# EasyEDA Pro project JLCEDA_AT_START_A423_V1.1.epro, schematic AT-START-A423

## Sheets
1 AT-Link-EZ V1.4: Create Date: 2024-03-27; Page Name: AT-Link-EZ V1.4; Project Name: AT-START-A423 V1.1; Schematic Name: AT-START-A423; Update Date: 2024-03-29; Company: Artery Technology; Page Size: A4; Version: 1.1
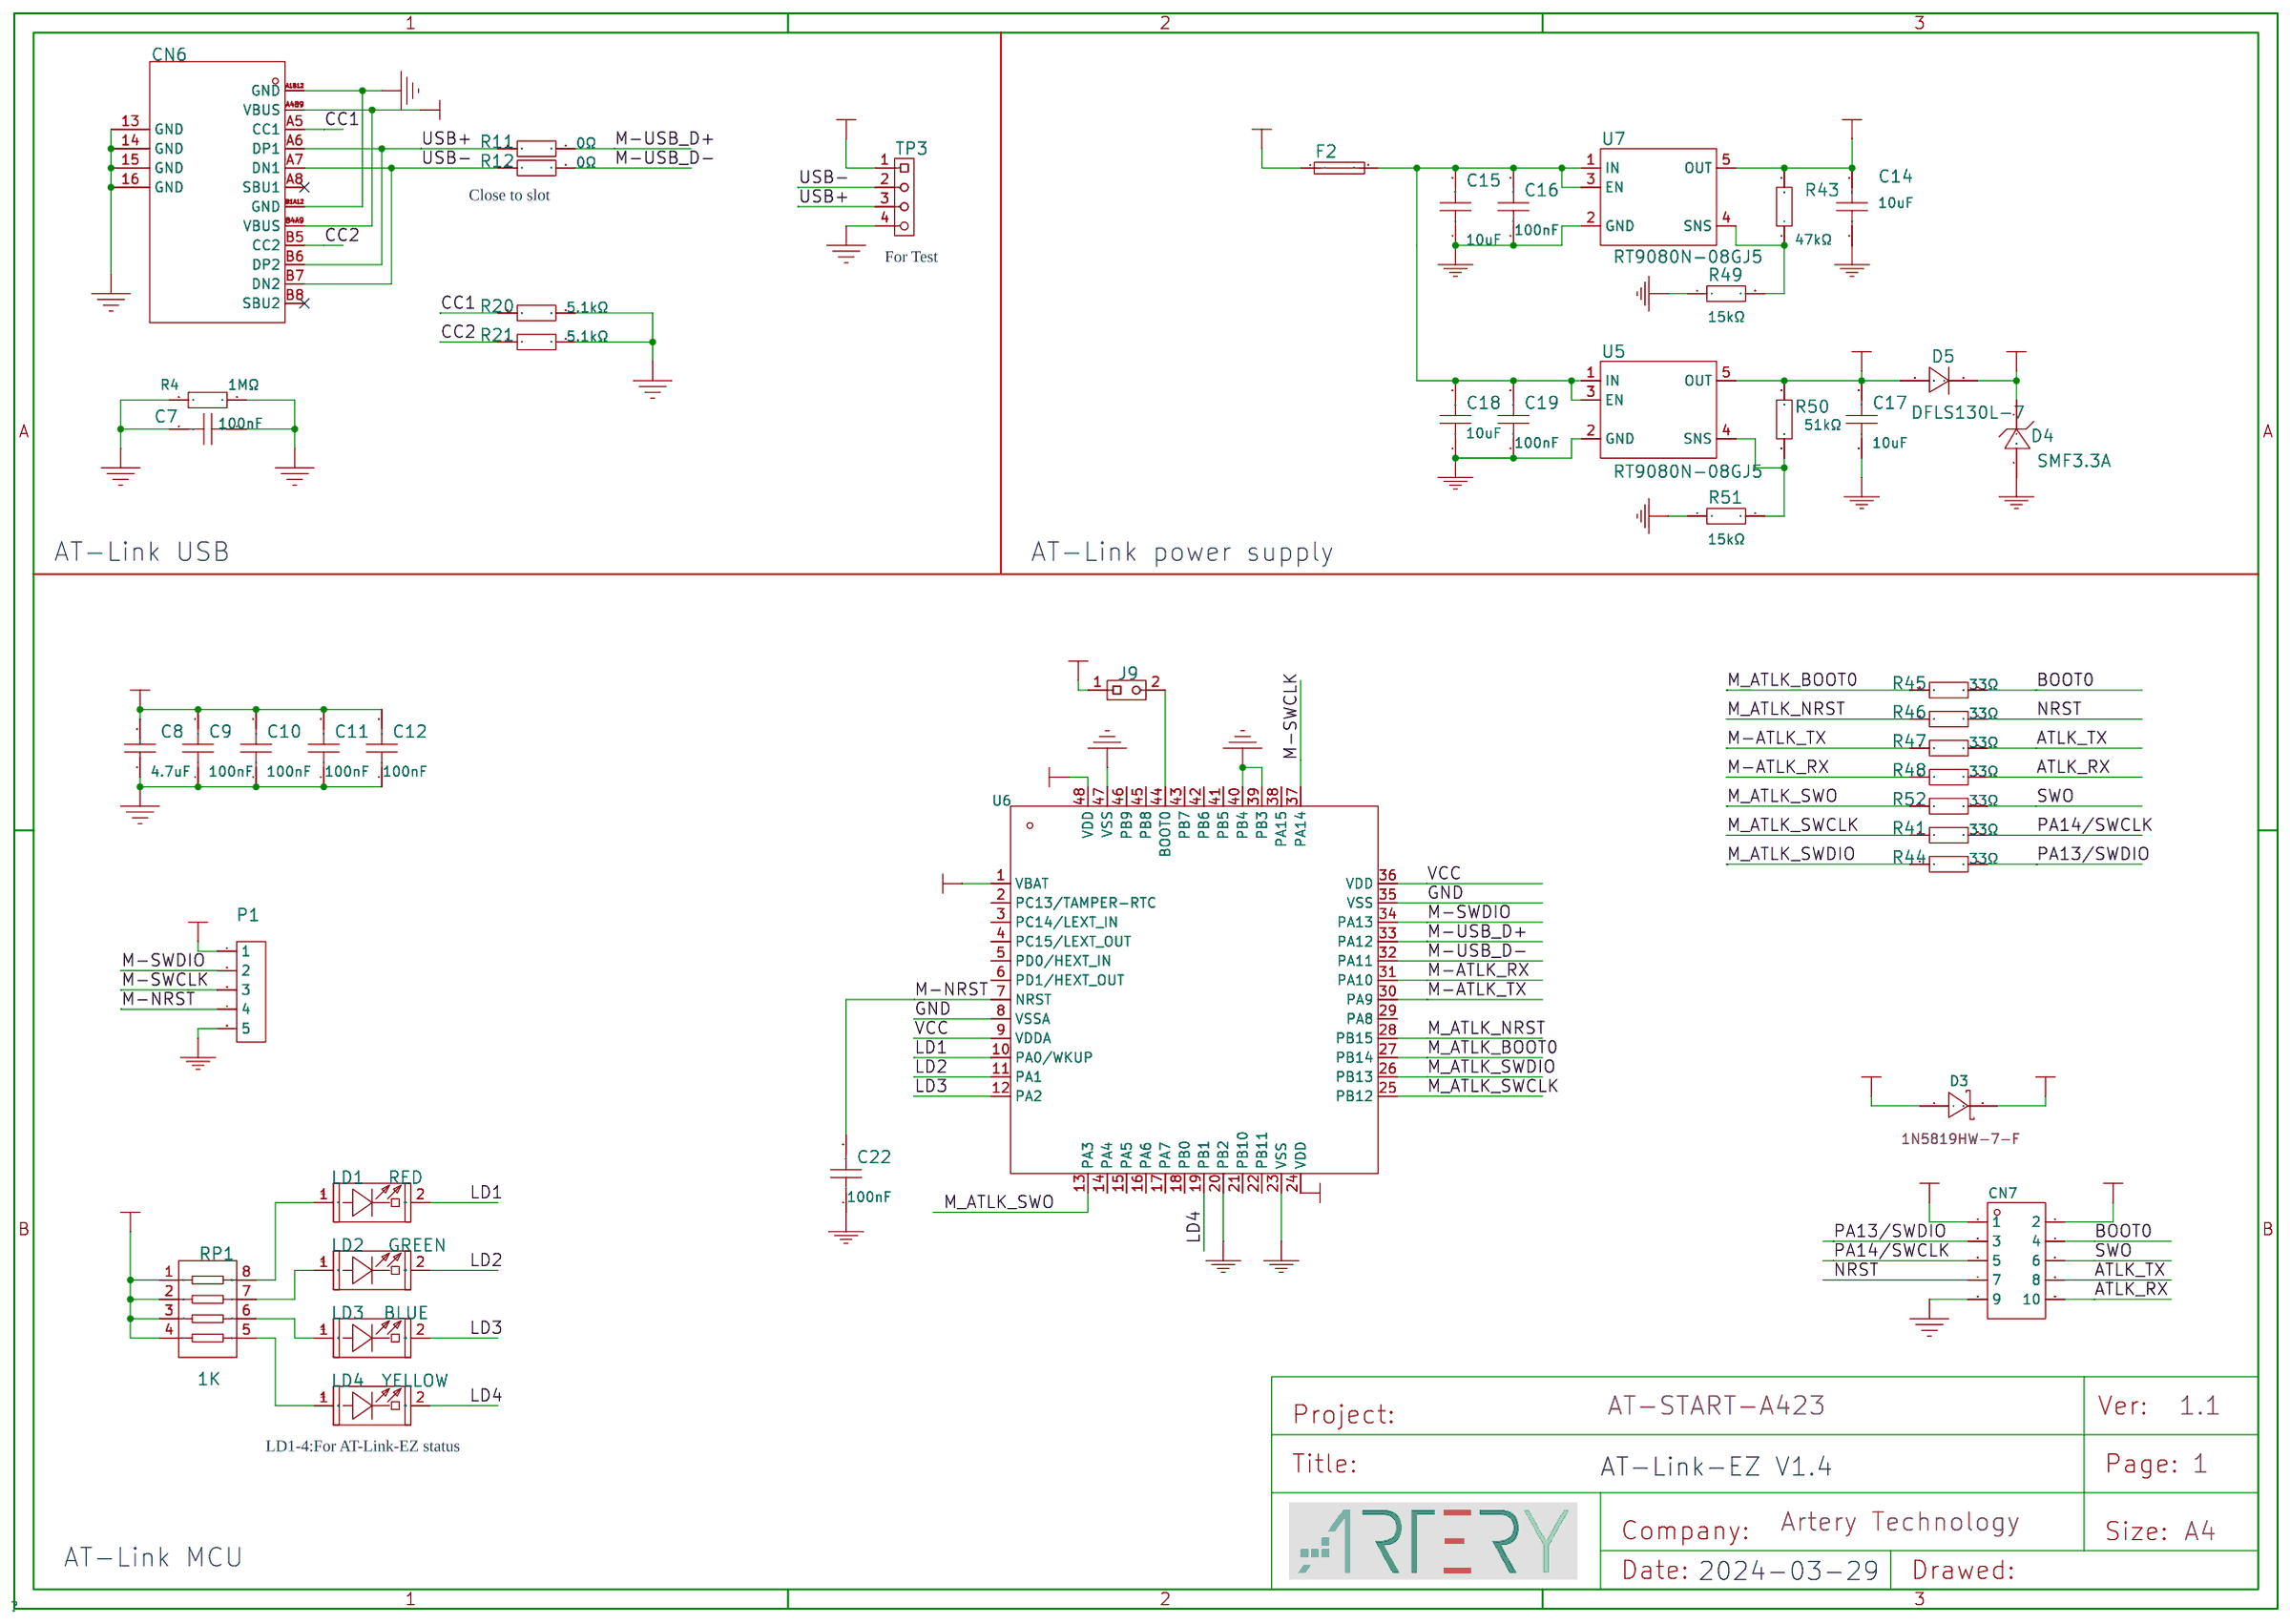
[diagram p0: AT-Link-EZ V1.4]
2 MCU: Page Name: MCU
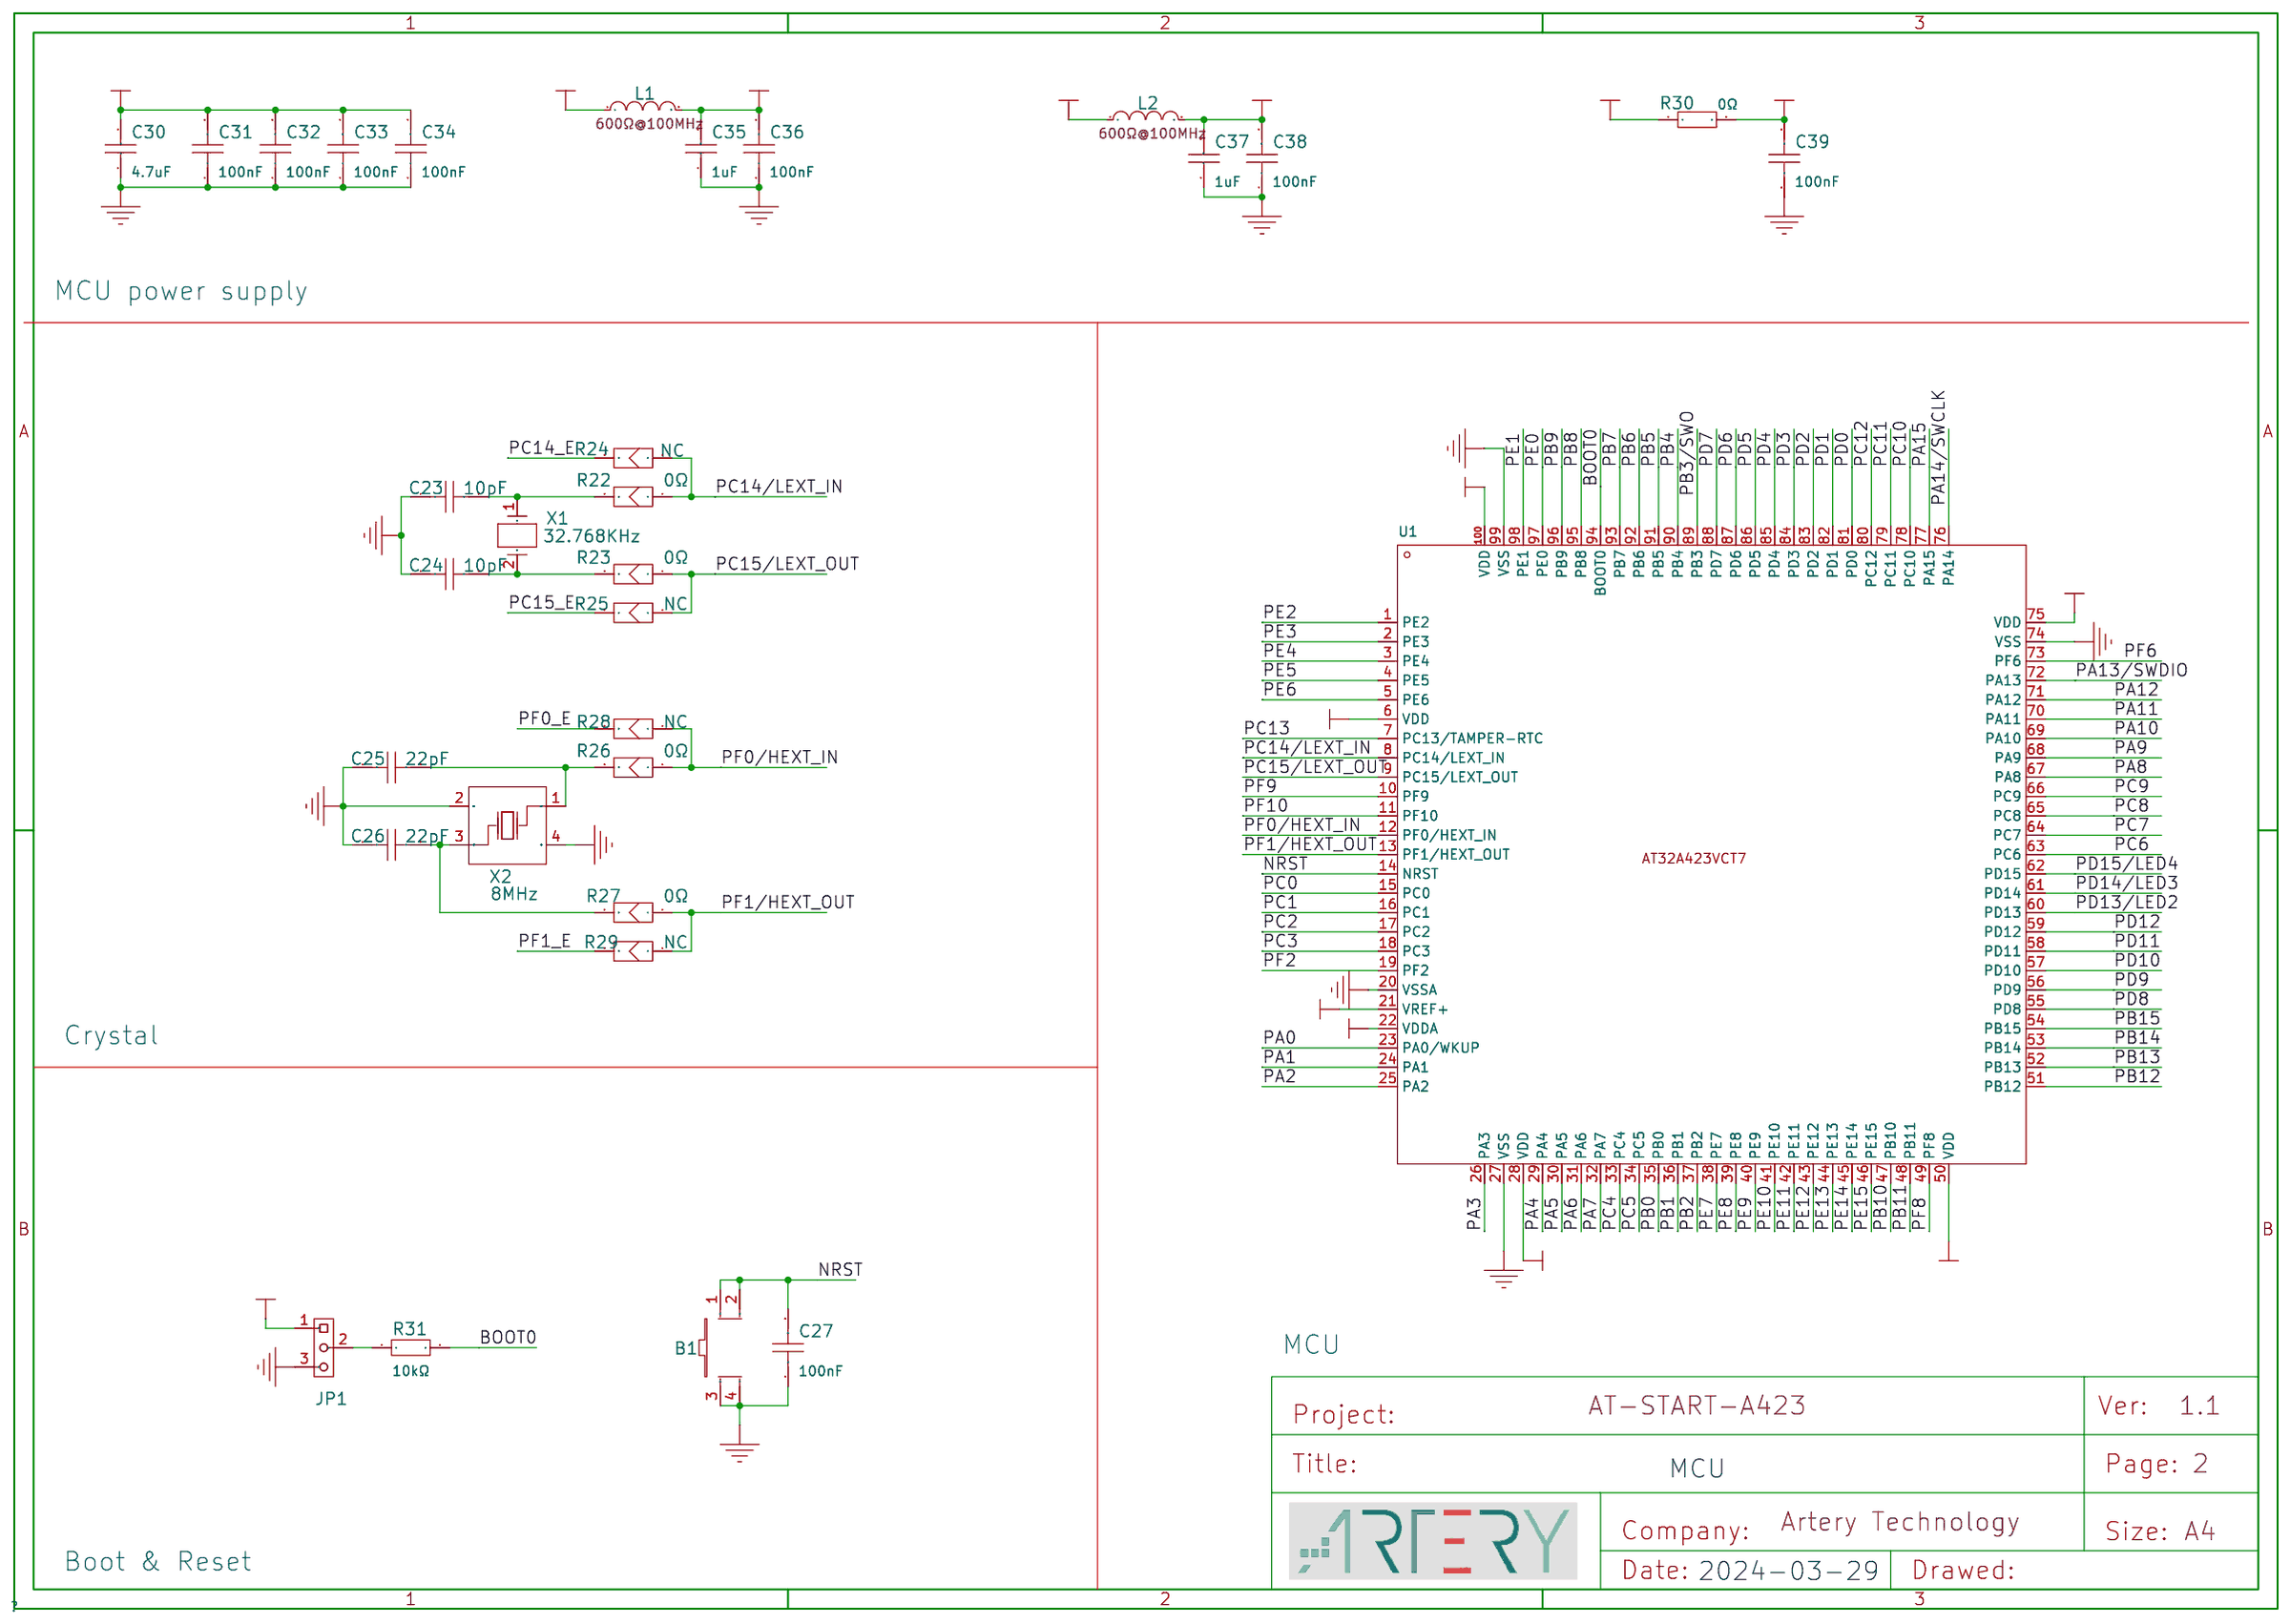
[diagram p1: MCU]
3 Power&Peripherals: Page Name: Power&Peripherals
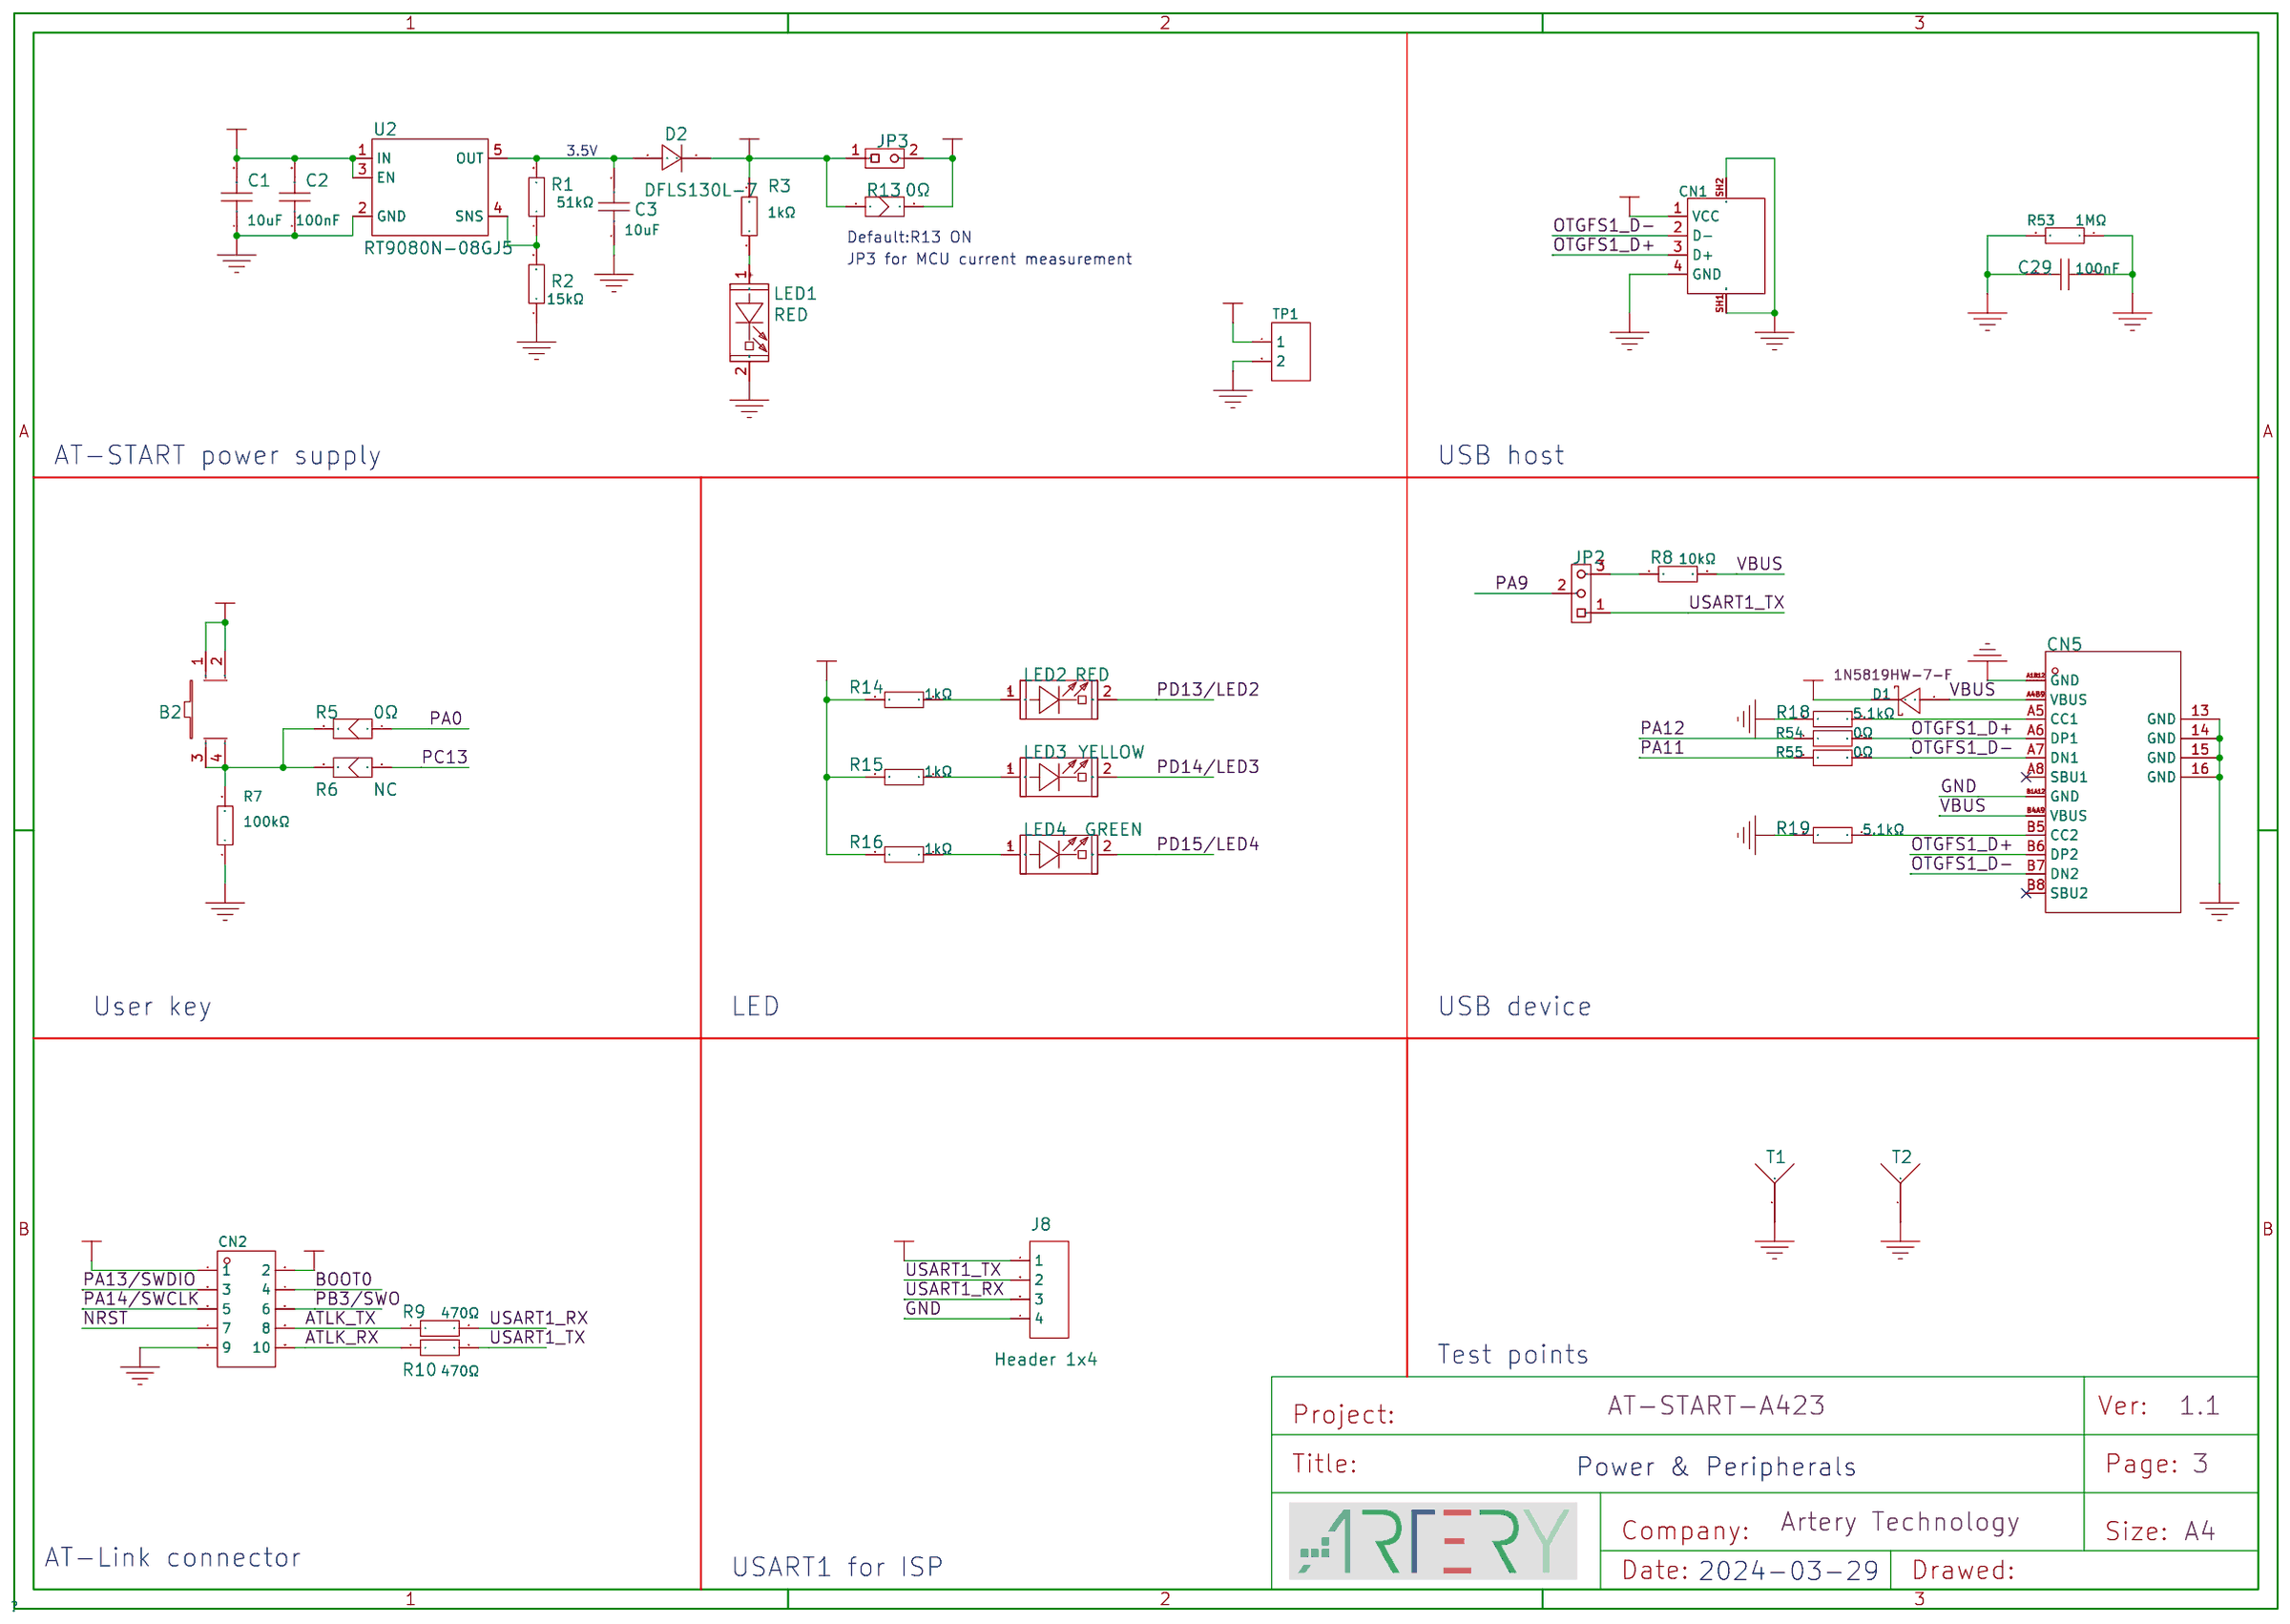
[diagram p2: Power&Peripherals]
4 Extension connectors: Page Name: Extension connectors; Update Date: 2024-04-30
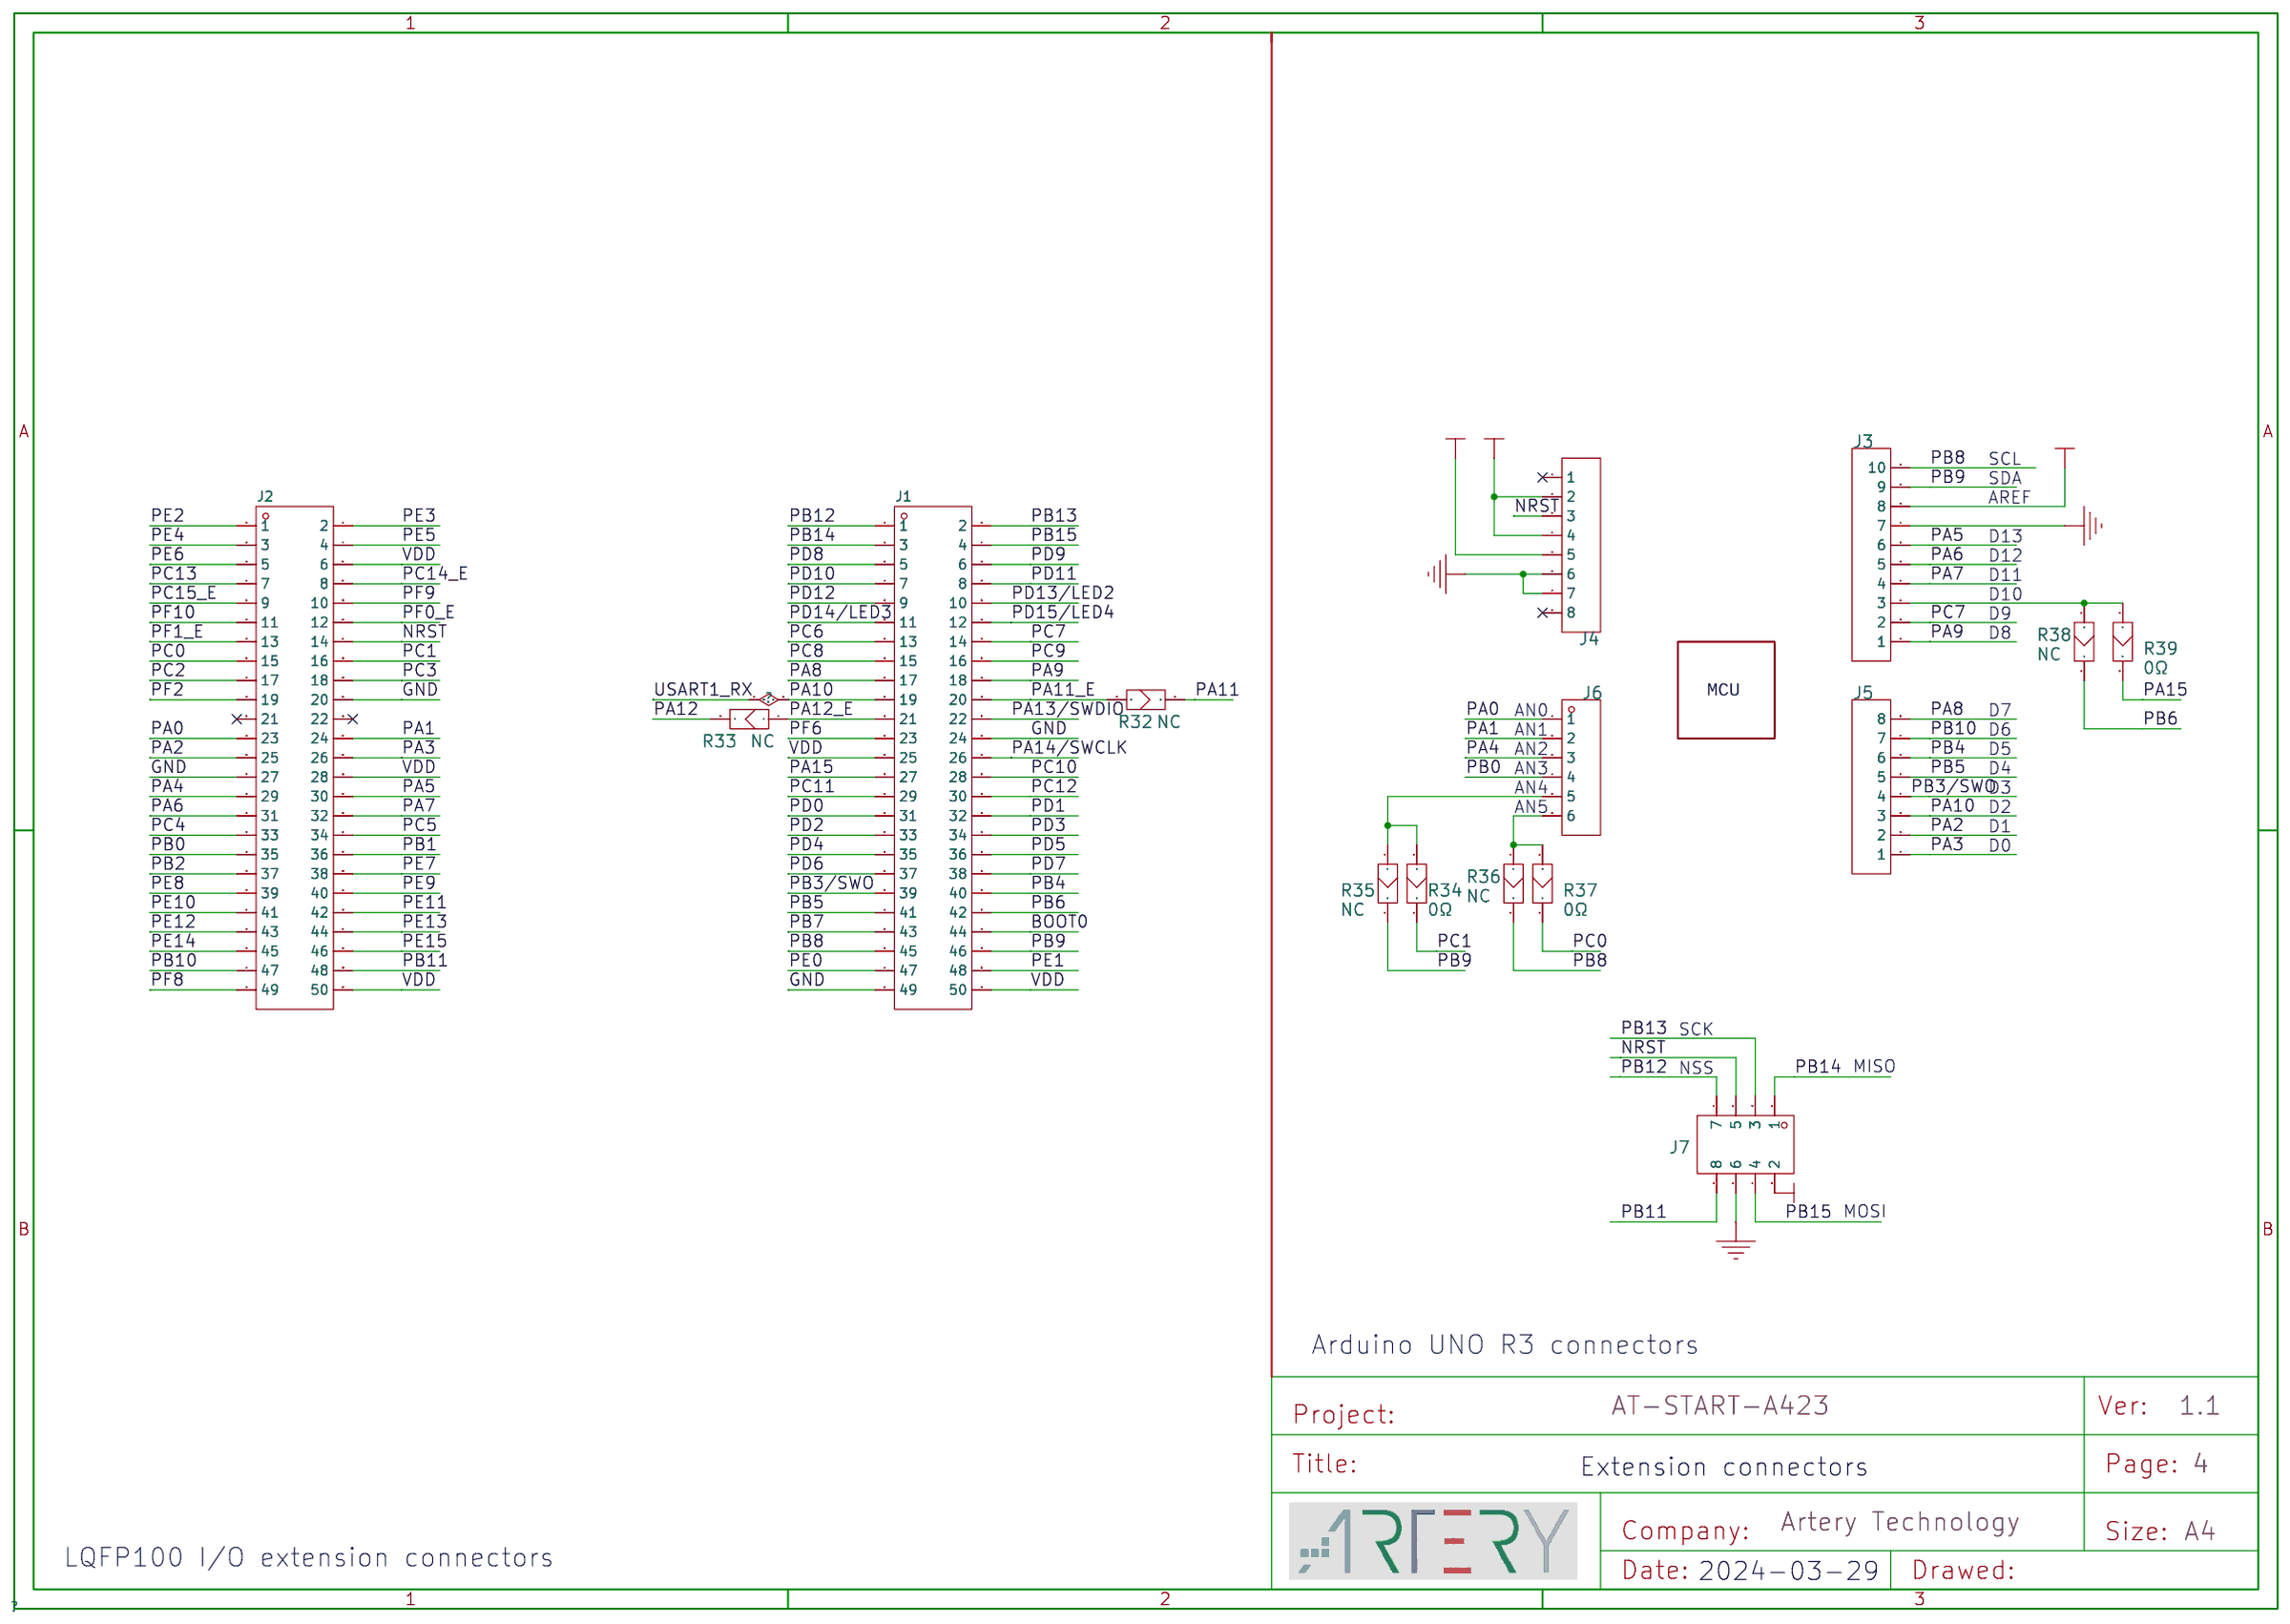
[diagram p3: Extension connectors]

## Parts
sheet AT-Link-EZ V1.4
C7  100nF  [C0603]
C8  4.7uF  [C0603]
C9  100nF  [C0603]
C10  100nF  [C0603]
C11  100nF  [C0603]
C12  100nF  [C0603]
C14  10uF  [C0603]
C15  10uF  [C0603]
C16  100nF  [C0603]
C17  10uF  [C0603]
C18  10uF  [C0603]
C19  100nF  [C0603]
C22  100nF  [C0603]
CN6  -  [USB-C-SMD_TYPEC-304-BCP16]
CN7  -  [HDR-TH_10P-P2.54-V-M-R2-C5-S2.54]
D3  1N5819HW-7-F  [SOD-123_L2.8-W1.8-LS3.7-FD]
D4  SMF3.3A  [SOD-123_L2.8-W1.8-LS3.7-RD]
D5  DFLS130L-7  [POWERDI-123_L2.8-W1.8-LS3.7-RD]
F2  SMD0603B050TF  [R0603]
J9  1X2P,Male,DIP_2.54  [HDR1X2]
LD1  RED  [LED0603]
LD2  GREEN  [LED0603]
LD3  BLUE  [LED0603]
LD4  YELLOW  [LED0603]
P1  HDR-M-2.54_1x5  [HDR-M-2.54_1X5]
R4  1MΩ  [R0603]
R11  0Ω  [R0603]
R12  0Ω  [R0603]
R20  5.1kΩ  [R0603]
R21  5.1kΩ  [R0603]
R41  33Ω  [R0603]
R43  47kΩ  [R0603]
R44  33Ω  [R0603]
R45  33Ω  [R0603]
R46  33Ω  [R0603]
R47  33Ω  [R0603]
R48  33Ω  [R0603]
R49  15kΩ  [R0603]
R50  51kΩ  [R0603]
R51  15kΩ  [R0603]
R52  33Ω  [R0603]
RP1  1K  [0603*4,8P4R]
TP3  1X4P_2.54F  [HDR1X4 - TOP]
U5  RT9080N-08GJ5  [SOT-23-5]
U6  -  [LQFP-48_L7.0-W7.0-P0.50-LS9.0-BL]
U7  RT9080N-08GJ5  [SOT-23-5(1)]
sheet Extension connectors
J1  X6521WV-2x25H-C30D60  [HDR-TH_50P-2.54-V-M-R2-C25-S2.54]
J2  X6521WV-2x25H-C30D60  [HDR-TH_50P-2.54-V-M-R2-C25-S2.54]
J3  -  [AT-START-Connector 1x10]
J4  -  [AT-START-Connector 1x8]
J5  -  [AT-START-Connector 1x8]
J6  -  [AT-START-Connector 1x6]
J7  Header 4X2  [HDR2X4]
R32  NC  [SB-PAD]
R33  NC  [SB-PAD]
R34  0Ω  [SB-PAD]
R35  NC  [SB-PAD]
R36  NC  [SB-PAD]
R37  0Ω  [SB-PAD]
R38  NC  [SB-PAD]
R39  0Ω  [SB-PAD]
sheet MCU
B1  BUTTON_SMT,6.0x6.0x4.5mm  [BUTTON_SMT_6*6*5]
C23  10pF  [0603_C-M]
C24  10pF  [0603_C-M]
C25  22pF  [0603_C-M(1)]
C26  22pF  [0603_C-M(1)]
C27  100nF  [C0603]
C30  4.7uF  [C0603]
C31  100nF  [C0603]
C32  100nF  [C0603]
C33  100nF  [C0603]
C34  100nF  [C0603]
C35  1uF  [C0603]
C36  100nF  [C0603]
C37  1uF  [C0603]
C38  100nF  [C0603]
C39  100nF  [C0603]
JP1  Header 1x3  [HEADER 1X3]
L1  -  [L0603]
L2  -  [L0603]
R22  0Ω  [SB-PAD]
R23  0Ω  [SB-PAD]
R24  NC  [SB-PAD]
R25  NC  [SB-PAD]
R26  0Ω  [SB-PAD]
R27  0Ω  [SB-PAD]
R28  NC  [SB-PAD]
R29  NC  [SB-PAD]
R30  0Ω  [R0603]
R31  10kΩ  [R0603]
U1  -  [LQFP-100_L14.0-W14.0-P0.50-LS16.0-TL]
X1  32.768KHz  [XTAL_SOP - FC-12M]
X2  8MHz  [OSC-SMD_4P-L5.0-W3.2-BL]
sheet Power&Peripherals
B2  BUTTON_SMT,6.0x6.0x4.5mm  [BUTTON_SMT_6*6*5]
C1  10uF  [C0603]
C2  100nF  [C0603]
C3  10uF  [C0603]
C29  100nF  [C0603]
CN1  902-131A1011D10100  [USB-A-TH__USB-AF-90]
CN2  -  [HDR-TH_10P-P2.54-V-M-R2-C5-S2.54]
CN5  -  [USB-C-SMD_TYPEC-304-BCP16]
D1  1N5819HW-7-F  [SOD-123_L2.8-W1.8-LS3.7-FD]
D2  DFLS130L-7  [POWERDI-123_L2.8-W1.8-LS3.7-RD]
J8  Header 1x4  [HDR1X4]
JP2  Header 1x3  [HEADER 1X3]
JP3  NC(Header 1x2)  [HDR1X2]
LED1  RED  [LED0603]
LED2  RED  [LED0603]
LED3  YELLOW  [LED0603]
LED4  GREEN  [LED0603]
R1  51kΩ  [R0603]
R2  15kΩ  [R0603]
R3  1kΩ  [R0603]
R5  0Ω  [SB-PAD]
R6  NC  [SB-PAD]
R7  100kΩ  [R0603]
R8  10kΩ  [R0603]
R9  470Ω  [R0603]
R10  470Ω  [R0603]
R13  0Ω  [SB-PAD]
R14  1kΩ  [R0603]
R15  1kΩ  [R0603]
R16  1kΩ  [R0603]
R18  5.1kΩ  [R0603]
R19  5.1kΩ  [R0603]
R53  1MΩ  [R0603]
R54  0Ω  [R0603]
R55  0Ω  [R0603]
T1  Testpoint  [TESTHOOK]
T2  Testpoint  [TESTHOOK]
TP1  -  [AT-START-TEST-POINT 1X2]
U2  RT9080N-08GJ5  [SOT-23-5(1)]

## Library data of the parts
C2 C7 C9-C12 C16 C19 C22 C27 C29 C31-C34 C36 C38 C39 = CC0603KRX7R9BB104: 容值:100nF;精度:±10%;额定电压:50V;温度系数:X7R;; LCSC Part Name: 100nF ±10% 50V; Supplier Part: C14663; Manufacturer: YAGEO(国巨); Supplier Footprint: 0603; JLCPCB Part Class: Basic Part; Datasheet: https://atta.szlcsc.com/upload/public/pdf/source/20170116/1484561234239.pdf; Supplier: LCSC; Tolerance: ±10%; Voltage Rated: 50V; Temperature Coefficient: X7R
C8 C30 = CL10A475KO8NNNC: 容值:4.7uF;精度:±10%;额定电压:16V;温度系数:X5R;; LCSC Part Name: 4.7uF ±10% 16V; Supplier Part: C19666; Manufacturer: SAMSUNG(三星); Supplier Footprint: 0603; JLCPCB Part Class: Basic Part; Datasheet: https://atta.szlcsc.com/upload/public/pdf/source/20160103/1457707703134.pdf; Supplier: LCSC; Tolerance: ±10%; Voltage Rated: 16V; Temperature Coefficient: X5R
C1 C3 C14 C15 C17 C18 = CL10A106KP8NNNC: 容值:10uF;精度:±10%;额定电压:10V;温度系数:X5R;; LCSC Part Name: 10uF ±10% 10V; Supplier Part: C19702; Manufacturer: SAMSUNG(三星); Supplier Footprint: 0603; JLCPCB Part Class: Basic Part; Datasheet: https://atta.szlcsc.com/upload/public/pdf/source/20160103/1457707703378.pdf; Supplier: LCSC; Tolerance: ±10%; Voltage Rated: 10V; Temperature Coefficient: X5R
CN5 CN6 = TYPEC-304-BCP16: 连接器类型:Type-C;标准:USB 3.1;公母:母座;触点数量:16.0;端口数量:1;安装方式:卧贴;额定电流 - 电源:3A;工作温度范围:-25~+85;焊接温度(最大值):260;; Supplier Part: C720629; Manufacturer: XUNPU(讯普); Supplier Footprint: SMD; JLCPCB Part Class: Extended Part; Datasheet: https://atta.szlcsc.com/upload/public/pdf/source/20211022/DACD6552F639E9483017DE6DC0E61150.pdf; Supplier: LCSC; Connector Type: Type-C; Standard: USB 3.1; Gender: 母座; Number of Contacts: 16.0; Number of Ports: 1; Mounting Sytle: 卧贴; Current Rating - Power (Max): 3A; Operating Temperature Range: -25~+85; Welding Temperature (Max): 260
CN2 CN7 = Z-21310110021001: 间距:2.54mm;总PIN位数:10;排数:2;插针结构:-;行距:2.54mm;安装类型:直插;圆针/方针:-;额定电流:-;额定电压:-;配合针长度:-;塑高:-;触头材质:黄铜;触头镀层:-;颜色:黑色;; LCSC Part Name: 2.54mm; Supplier Part: C115170; Manufacturer: Nextron(台湾正凌); Supplier Footprint: 插件,P=2.54mm; JLCPCB Part Class: Extended Part; Datasheet: https://atta.szlcsc.com/upload/public/pdf/source/20170626/1498446033809.pdf; Supplier: LCSC; Pitch: 2.54mm; Number of Pins: 10; Number of Rows: 2; Row Spacing: 2.54mm; Mounting Type: 直插; Contact Material: 黄铜; Color: 黑色
D1 D3 = 1N5819HW-7-F: 直流反向耐压(Vr):40V;平均整流电流(Io):1A;正向压降(Vf):450mV@1A;; LCSC Part Name: 40V 1A 450mV@1A; Supplier Part: C82544; Manufacturer: DIODES(美台); Supplier Footprint: SOD-123; JLCPCB Part Class: 扩展库; Datasheet: https://atta.szlcsc.com/upload/public/pdf/source/20161024/1477288459223.pdf; Supplier: LCSC; Reverse Voltage (Vr): 40V; Average Rectified Current (Io): 1A; Forward Voltage (Vf@If): 450mV@1A
D4 = SMF3.3A: Supplier: LCSC; Supplier Part: C283866; Manufacturer: DOWO; Paste Type: expand
D2 D5 = DFLS130L-7_POWERDI-123_L2.8-W1.8-LS3.7-RD: Supplier: LCSC; Supplier Part: C110493; Manufacturer: Diodes Incorporated; Paste Type: expand
F2 = SMD0603B050TF: Supplier: LCSC; Supplier Part: C269154; Manufacturer: Brightking Elec (TAIWAN); Manufacturer Part: SMD0603B035TF; Paste Type: expand
J9 = 1X2P,Male,DIP_2.54
LD1 = RED
LD2 = GREEN
LD3 = BLUE
LD4 = YELLOW
P1 = HDR-M-2.54_1x5: Supplier Part: C358687; Supplier: LCSC
R4 R53 = RC0603FR-071ML: 阻值:1MΩ;精度:±1%;功率:100mW;温度系数:±100ppm/;最大工作电压:75V;工作温度范围:-55~+155;; LCSC Part Name: 1MΩ ±1%; Supplier Part: C105578; Manufacturer: YAGEO(国巨); Supplier Footprint: 0603; JLCPCB Part Class: Extended Part; Datasheet: https://atta.szlcsc.com/upload/public/pdf/source/20181102/C105578_67A9388250AF143DE4682E62257D2969.pdf; Supplier: LCSC; Tolerance: ±1%; Power(Watts): 100mW; Temperature Coefficient: ±100ppm/; Overload Voltage (Max): 75V; Operating Temperature Range: -55~+155
R11 R12 R30 = 0603WAF0000T5E: 电阻类型:厚膜电阻;阻值:0Ω;精度:±1%;功率:1/10W;温度系数:-;最大工作电压:75V;工作温度范围:-55~+155;; LCSC Part Name: 0Ω ±1%; Supplier Part: C21189; Manufacturer: UNI-ROYAL(厚声); Supplier Footprint: 0603; JLCPCB Part Class: Basic Part; Datasheet: https://atta.szlcsc.com/upload/public/pdf/source/20200306/C422600_1E6D84923E4A46A82E41ADD87F860B5C.pdf; Supplier: LCSC; Type: 厚膜电阻; Tolerance: ±1%; Power(Watts): 1/10W; Overload Voltage (Max): 75V; Operating Temperature Range: -55~+155
R18-R21 = 0603WAF5101T5E: 电阻类型:厚膜电阻;阻值:5.1kΩ;精度:±1%;功率:1/10W;温度系数:±100ppm/;最大工作电压:75V;工作温度范围:-55~+155;; LCSC Part Name: 5.1kΩ ±1%; Supplier Part: C23186; Manufacturer: UNI-ROYAL(厚声); Supplier Footprint: 0603; JLCPCB Part Class: Basic Part; Datasheet: https://atta.szlcsc.com/upload/public/pdf/source/20200306/C422600_1E6D84923E4A46A82E41ADD87F860B5C.pdf; Supplier: LCSC; Type: 厚膜电阻; Tolerance: ±1%; Power(Watts): 1/10W; Temperature Coefficient: ±100ppm/; Overload Voltage (Max): 75V; Operating Temperature Range: -55~+155
R41 R44-R48 R52 = 0603WAF330JT5E: 电阻类型:厚膜电阻;阻值:33Ω;精度:±1%;功率:1/10W;温度系数:±100ppm/;最大工作电压:75V;工作温度范围:-55~+155;; LCSC Part Name: 33Ω ±1%; Supplier Part: C23140; Manufacturer: UNI-ROYAL(厚声); Supplier Footprint: 0603; JLCPCB Part Class: Basic Part; Datasheet: https://atta.szlcsc.com/upload/public/pdf/source/20200306/C422600_1E6D84923E4A46A82E41ADD87F860B5C.pdf; Supplier: LCSC; Type: 厚膜电阻; Tolerance: ±1%; Power(Watts): 1/10W; Temperature Coefficient: ±100ppm/; Overload Voltage (Max): 75V; Operating Temperature Range: -55~+155
R43 = 0603WAF4702T5E: 电阻类型:厚膜电阻;阻值:47kΩ;精度:±1%;功率:1/10W;温度系数:±100ppm/;最大工作电压:75V;工作温度范围:-55~+155;; LCSC Part Name: 47kΩ ±1%; Supplier Part: C25819; Manufacturer: UNI-ROYAL(厚声); Supplier Footprint: 0603; JLCPCB Part Class: Basic Part; Datasheet: https://atta.szlcsc.com/upload/public/pdf/source/20200306/C422600_1E6D84923E4A46A82E41ADD87F860B5C.pdf; Supplier: LCSC; Type: 厚膜电阻; Tolerance: ±1%; Power(Watts): 1/10W; Temperature Coefficient: ±100ppm/; Overload Voltage (Max): 75V; Operating Temperature Range: -55~+155
R2 R49 R51 = 0603WAF1502T5E: 电阻类型:厚膜电阻;阻值:15kΩ;精度:±1%;功率:1/10W;温度系数:±100ppm/;最大工作电压:75V;工作温度范围:-55~+155;; LCSC Part Name: 15kΩ ±1%; Supplier Part: C22809; Manufacturer: UNI-ROYAL(厚声); Supplier Footprint: 0603; JLCPCB Part Class: Basic Part; Datasheet: https://atta.szlcsc.com/upload/public/pdf/source/20200306/C422600_1E6D84923E4A46A82E41ADD87F860B5C.pdf; Supplier: LCSC; Type: 厚膜电阻; Tolerance: ±1%; Power(Watts): 1/10W; Temperature Coefficient: ±100ppm/; Overload Voltage (Max): 75V; Operating Temperature Range: -55~+155
R1 R50 = 0603WAF5102T5E: 电阻类型:厚膜电阻;阻值:51kΩ;精度:±1%;功率:1/10W;温度系数:±100ppm/;最大工作电压:75V;工作温度范围:-55~+155;; LCSC Part Name: 51kΩ ±1%; Supplier Part: C23196; Manufacturer: UNI-ROYAL(厚声); Supplier Footprint: 0603; JLCPCB Part Class: Basic Part; Datasheet: https://atta.szlcsc.com/upload/public/pdf/source/20200306/C422600_1E6D84923E4A46A82E41ADD87F860B5C.pdf; Supplier: LCSC; Type: 厚膜电阻; Tolerance: ±1%; Power(Watts): 1/10W; Temperature Coefficient: ±100ppm/; Overload Voltage (Max): 75V; Operating Temperature Range: -55~+155
RP1 = 1K: Comment: 33R
TP3 = 1X4P_2.54F
U5 = RT9080N-08GJ5
U6 = AT32F403ACxT7: 由官方提供; Manufacturer: Artery Technology
U2 U7 = RT9080N-08GJ5_SOT-23-5
J1 J2 = X6521WV-2x25H-C30D60: 间距:2.54mm;总PIN位数:50;排数:2;插针结构:2x25P;行距:2.54mm;安装类型:直插;圆针/方针:方针;额定电流:3A;额定电压:250V;配合针长度:6mm;塑高:2.5mm;端接针长度:3mm;触头材质:黄铜;触头镀层:金;工作温度范围:-40~+105;焊接温度(最大值):260;颜色:黑色;; LCSC Part Name: 2.54mm 2x25P 直插 方针; Supplier Part: C725897; Manufacturer: XKB Connectivity(中国星坤); Supplier Footprint: 直插,P=2.54mm; JLCPCB Part Class: 扩展库; Datasheet: https://atta.szlcsc.com/upload/public/pdf/source/20211009/DE33EBA4104B5B447A7BD8383FBBA145.pdf; Supplier: LCSC; Pitch: 2.54mm; Number of Pins: 50; Number of Rows: 2; Pin Structure: 2x25P; Row Spacing: 2.54mm; Mounting Type: 直插; Circluar Pins/Square Pins: 方针; Current Rating (Max): 3A; Voltage Rating (Max): 250V; Length of Mating Pin: 6mm; Insulation Height: 2.5mm; Length of End Connection Pin: 3mm; Contact Material: 黄铜; Contact Plating: 金; Operating Temperature Range: -40~+105; Welding Temperature (Max): 260; Color: 黑色
J3 = 2.54-1*10P母: 间距:2.54mm;总孔位数:10;排数:1;插孔结构:1x10P;行距:-;安装类型:直插;塑高:-;触头材质:-;触头镀层:-;; LCSC Part Name: 2.54mm 镀金; Supplier Part: C35445; Manufacturer: BOOMELE(博穆精密); Supplier Footprint: 插件,P=2.54mm; JLCPCB Part Class: Extended Part; Datasheet: https://atta.szlcsc.com/upload/public/pdf/source/20200813/C35445_A4147CED0A1C9075722E373C7771E928.pdf; Supplier: LCSC; Pitch: 2.54mm; Number of Holes: 10; Number of Rows: 1; Holes Structure: 1x10P; Mounting Type: 直插
J4 J5 = 2.54-1*8P母环保: 间距:2.54mm;总孔位数:8;排数:1;插孔结构:1x8P;行距:-;安装类型:直插;塑高:-;触头材质:-;触头镀层:-;; LCSC Part Name: 2.54mm; Supplier Part: C27438; Manufacturer: BOOMELE(博穆精密); Supplier Footprint: 插件,P=2.54mm; JLCPCB Part Class: Extended Part; Datasheet: https://atta.szlcsc.com/upload/public/pdf/source/20151109/1457707554453.pdf; Supplier: LCSC; Pitch: 2.54mm; Number of Holes: 8; Number of Rows: 1; Holes Structure: 1x8P; Mounting Type: 直插
J6 = 2.54-1*6P母: 间距:2.54mm;总孔位数:6;排数:1;插孔结构:1x6P;行距:-;安装类型:直插;塑高:-;触头材质:-;触头镀层:-;; LCSC Part Name: 2.54mm; Supplier Part: C40877; Manufacturer: BOOMELE(博穆精密); Supplier Footprint: 插件,P=2.54mm; JLCPCB Part Class: Extended Part; Datasheet: https://atta.szlcsc.com/upload/public/pdf/source/20151109/1457707559772.pdf; Supplier: LCSC; Pitch: 2.54mm; Number of Holes: 6; Number of Rows: 1; Holes Structure: 1x6P; Mounting Type: 直插
J7 = Header 4X2: LatestRevisionDate: 17-Jul-2002; LatestRevisionNote: Re-released for DXP Platform.; Publisher: Altium Limited
R5 R6 R13 R22-R24 R26-R29 R32-R39 = NC_SB-PAD
B1 = BUTTON_SMT,6.0x6.0x4.5mm
C23 = 10pF
C24 = 10pF_0603_C-M
C25 C26 = 22pF_0603_C-M
C35 C37 = CL10A105KB8NNNC: 容值:1uF;精度:±10%;额定电压:50V;温度系数:X5R;; LCSC Part Name: 1uF ±10% 50V; Supplier Part: C15849; Manufacturer: SAMSUNG(三星); Supplier Footprint: 0603; JLCPCB Part Class: Basic Part; Datasheet: https://atta.szlcsc.com/upload/public/pdf/source/20160103/1457707679084.pdf; Supplier: LCSC; Tolerance: ±10%; Voltage Rated: 50V; Temperature Coefficient: X5R
JP1 JP2 = Header 1x3
L1 L2 = UPZ1608E601-1R0TF: 标称阻抗@测试频率:600Ω@100MHz;误差:±25%;直流电阻(RDC):150mΩ;额定电流:1A;电路数:1;; LCSC Part Name: 600Ω@100MHz ±25%; Supplier Part: C133527; Manufacturer: Sunlord(顺络); Supplier Footprint: 0603; JLCPCB Part Class: Extended Part; Datasheet: https://atta.szlcsc.com/upload/public/pdf/source/20210916/3C06D8971A361A4569490E57F6B8A429.pdf; Supplier: LCSC; Impedance @ Frequency: 600Ω@100MHz; Tolerance: ±25%; DC Resistance: 150mΩ; Current Rating: 1A; Circuits: 1
R25 = NC
R8 R31 = 0603WAF1002T5E: 电阻类型:厚膜电阻;阻值:10kΩ;精度:±1%;功率:1/10W;温度系数:±100ppm/;最大工作电压:75V;工作温度范围:-55~+155;; LCSC Part Name: 10kΩ ±1%; Supplier Part: C25804; Manufacturer: UNI-ROYAL(厚声); Supplier Footprint: 0603; JLCPCB Part Class: Basic Part; Datasheet: https://atta.szlcsc.com/upload/public/pdf/source/20200306/C422600_1E6D84923E4A46A82E41ADD87F860B5C.pdf; Supplier: LCSC; Type: 厚膜电阻; Tolerance: ±1%; Power(Watts): 1/10W; Temperature Coefficient: ±100ppm/; Overload Voltage (Max): 75V; Operating Temperature Range: -55~+155
U1 = AT32F423VCT7
X1 = 32.768KHz
X2 = 8MHz_OSC-SMD_4P-L5.0-W3.2-BL: Supplier: LCSC; Manufacturer: YXC; Manufacturer Part: X50328MSD4SC; Supplier Part: C16422; Paste Type: recommend
B2 = BUTTON_SMT,6.0x6.0x4.5mm_BUTTON_SMT_6*6*5
CN1 = 902-131A1011D10100: 连接器类型:Type-A;标准:USB 2.0;公母:母座;触点数量:4;端口数量:1;; LCSC Part Name: Type-A 母座; Supplier Part: C2345; Manufacturer: 精拓金; Supplier Footprint: 插件; JLCPCB Part Class: 扩展库; Datasheet: https://atta.szlcsc.com/upload/public/pdf/source/20210226/C2345_C912E0062DF8F3B5668E29214CFCD16E.pdf; Supplier: LCSC; Connector Type: Type-A; Standard: USB 2.0; Gender: 母座; Number of Contacts: 4; Number of Ports: 1
J8 = Header 1x4: Supplier Part: C124378; Supplier: LCSC
JP3 = NC(Header 1x2)
LED1 = RED_LED0603(1)
LED2 = RED_LED0603
LED3 = YELLOW_LED0603
LED4 = GREEN_LED0603
R3 R14-R16 = 0603WAF1001T5E: 电阻类型:厚膜电阻;阻值:1kΩ;精度:±1%;功率:1/10W;温度系数:±100ppm/;最大工作电压:75V;工作温度范围:-55~+155;; LCSC Part Name: 1kΩ ±1%; Supplier Part: C21190; Manufacturer: UNI-ROYAL(厚声); Supplier Footprint: 0603; JLCPCB Part Class: Basic Part; Datasheet: https://atta.szlcsc.com/upload/public/pdf/source/20200306/C422600_1E6D84923E4A46A82E41ADD87F860B5C.pdf; Supplier: LCSC; Type: 厚膜电阻; Tolerance: ±1%; Power(Watts): 1/10W; Temperature Coefficient: ±100ppm/; Overload Voltage (Max): 75V; Operating Temperature Range: -55~+155
R7 = 0603WAF1003T5E: 电阻类型:厚膜电阻;阻值:100kΩ;精度:±1%;功率:1/10W;温度系数:±100ppm/;最大工作电压:75V;工作温度范围:-55~+155;; LCSC Part Name: 100kΩ ±1%; Supplier Part: C25803; Manufacturer: UNI-ROYAL(厚声); Supplier Footprint: 0603; JLCPCB Part Class: Basic Part; Datasheet: https://atta.szlcsc.com/upload/public/pdf/source/20200306/C422600_1E6D84923E4A46A82E41ADD87F860B5C.pdf; Supplier: LCSC; Type: 厚膜电阻; Tolerance: ±1%; Power(Watts): 1/10W; Temperature Coefficient: ±100ppm/; Overload Voltage (Max): 75V; Operating Temperature Range: -55~+155
R9 R10 = 0603WAF4700T5E: 电阻类型:厚膜电阻;阻值:470Ω;精度:±1%;功率:1/10W;温度系数:±100ppm/;最大工作电压:75V;工作温度范围:-55~+155;; LCSC Part Name: 470Ω ±1%; Supplier Part: C23179; Manufacturer: UNI-ROYAL(厚声); Supplier Footprint: 0603; JLCPCB Part Class: Basic Part; Datasheet: https://atta.szlcsc.com/upload/public/pdf/source/20200306/C422600_1E6D84923E4A46A82E41ADD87F860B5C.pdf; Supplier: LCSC; Type: 厚膜电阻; Tolerance: ±1%; Power(Watts): 1/10W; Temperature Coefficient: ±100ppm/; Overload Voltage (Max): 75V; Operating Temperature Range: -55~+155
R54 R55 = 0603WAF220JT5E: 电阻类型:厚膜电阻;阻值:22Ω;精度:±1%;功率:100mW;温度系数:±100ppm/;最大工作电压:75V;工作温度范围:-55~+155;; LCSC Part Name: 22Ω ±1% 100mW; Supplier Part: C23345; Manufacturer: UNI-ROYAL(厚声); Supplier Footprint: 0603; JLCPCB Part Class: 基础库; Datasheet: https://atta.szlcsc.com/upload/public/pdf/source/20200306/C422600_1E6D84923E4A46A82E41ADD87F860B5C.pdf; Supplier: LCSC; Type: 厚膜电阻; Tolerance: ±1%; Power(Watts): 100mW; Temperature Coefficient: ±100ppm/; Overload Voltage (Max): 75V; Operating Temperature Range: -55~+155
T1 = Testpoint_TESTHOOK: LatestRevisionDate: 17-Jul-2002; LatestRevisionNote: Re-released for DXP Platform.; Publisher: Altium Limited
T2 = Testpoint: LatestRevisionDate: 17-Jul-2002; LatestRevisionNote: Re-released for DXP Platform.; Publisher: Altium Limited
TP1 = 2.54-1*2P母: 间距:2.54mm;总孔位数:2;排数:1;插孔结构:1x2P;行距:-;安装类型:直插;塑高:-;触头材质:-;触头镀层:-;; LCSC Part Name: 2.54mm; Supplier Part: C49661; Manufacturer: BOOMELE(博穆精密); Supplier Footprint: 插件,P=2.54mm; JLCPCB Part Class: Extended Part; Datasheet: https://atta.szlcsc.com/upload/public/pdf/source/20151109/1457707570988.pdf; Supplier: LCSC; Pitch: 2.54mm; Number of Holes: 2; Number of Rows: 1; Holes Structure: 1x2P; Mounting Type: 直插

## Nets
3V3: CN2.1 CN7.1 D2.1 D4.1 D5.1 J4.2 J4.4 J8.1 JP3.1 R3.2 R13.1 R14.2 R15.2 R16.2
5V: C1.2 C2.2 CN1.1(VCC) CN2.2 CN7.2 D1.2(K) D3.2(K) J4.5 J7.2 TP1.1 U2.1(IN) U2.3(EN)
GND: B1.3 B1.4 C1.1 C2.1 C3.1 C7.1 C8.1 C9.1 C10.1 C11.1 C12.1 C14.1 C15.1 C16.1 C17.1 C18.1 C19.1 C22.1 C23.1 C24.1 C25.1 C26.1 C27.1 C29.1 C30.1 C31.1 C32.1 C33.1 C34.1 C35.1 C36.1 C37.1 C38.1 C39.1 CN1.4(GND) CN2.9 CN5.A1B12(GND) CN5.B1A12(GND) CN6.A1B12(GND) CN6.B1A12(GND) CN7.9 D4.2 J1.24 J1.49 J2.20 J2.27 J3.7 J4.6 J4.7 J7.6 J8.4 JP1.3 LED1.2(CATHODE) P1.5 R2.1 R4.2 R7.1 R18.2 R19.2 R20.2 R21.2 R49.1 R51.1 R53.2 T1.1 T2.1 TP1.2 TP3.4 U1.20(VSSA) U1.27(VSS) U1.74(VSS) U1.99(VSS) U2.2(GND) U5.2(GND) U6.8(VSSA) U6.20(PB2) U6.23(VSS) U6.35(VSS) U6.39(PB3) U6.40(PB4) U6.47(VSS) U7.2(GND) X2.2(GND) X2.4(GND)
VBUS: CN5.A4B9(VBUS) CN5.B4A9(VBUS) D1.1(A) R8.2
VCC: C8.2 C9.2 C10.2 C11.2 C12.2 C14.2 J9.1 P1.1 R43.2 RP1.1 RP1.2 RP1.3 RP1.4 U6.1(VBAT) U6.9(VDDA) U6.24(VDD) U6.36(VDD) U6.48(VDD) U7.5(OUT)
VCC3.5V: C17.2 D5.2 R50.2 U5.5(OUT)
VDD: B2.1 B2.2 C30.2 C31.2 C32.2 C33.2 C34.2 C39.2 J1.25 J1.50 J2.6 J2.28 J2.50 JP1.1 JP3.2 L1.1 L2.1 R13.2 R30.1 R30.2 U1.6(VDD) U1.28(VDD) U1.50(VDD) U1.75(VDD) U1.100(VDD)
VDDA: C35.2 C36.2 L1.2 U1.22(VDDA)
ATLINK_5V: CN6.A4B9(VBUS) CN6.B4A9(VBUS) D3.1(A) F2.1 TP3.1
ATLK_RX: CN2.10 CN7.10 R10.1 R48.2
ATLK_TX: CN2.8 CN7.8 R9.1 R47.2
BOOT0: CN2.4 CN7.4 J1.44 R31.2 R45.2 U1.94(BOOT0)
CC1: CN6.A5(CC1) R20.1
CC2: CN6.B5(CC2) R21.1
EGND: C29.2 CN1.SH1 CN1.SH2 CN5.13(GND) CN5.14(GND) CN5.15(GND) CN5.16(GND) R53.1
EGND2: C7.2 CN6.13(GND) CN6.14(GND) CN6.15(GND) CN6.16(GND) R4.1
LD1: LD1.2(CATHODE) U6.10(PA0/WKUP)
LD2: LD2.2(CATHODE) U6.11(PA1)
LD3: LD3.2(CATHODE) U6.12(PA2)
LD4: LD4.2(CATHODE) U6.19(PB1)
M-ATLK_RX: R48.1 U6.31(PA10)
M-ATLK_TX: R47.1 U6.30(PA9)
M-NRST: C22.2 P1.4 U6.7(NRST)
M-SWCLK: P1.3 U6.37(PA14)
M-SWDIO: P1.2 U6.34(PA13)
M-USB_D+: R11.2 U6.33(PA12)
M-USB_D-: R12.2 U6.32(PA11)
M_ATLK_BOOT0: R45.1 U6.27(PB14)
M_ATLK_NRST: R46.1 U6.28(PB15)
M_ATLK_SWCLK: R41.1 U6.25(PB12)
M_ATLK_SWDIO: R44.1 U6.26(PB13)
M_ATLK_SWO: R52.1 U6.13(PA3)
NRST: B1.1 B1.2 C27.2 CN2.7 CN7.7 J2.14 J4.3 J7.5 R46.2 U1.14(NRST)
OTGFS1_D+: CN1.3(D+) CN5.A6(DP1) CN5.B6(DP2) R54.2
OTGFS1_D-: CN1.2(D-) CN5.A7(DN1) CN5.B7(DN2) R55.2
PA0: J2.23 J6.1 R5.1 U1.23(PA0/WKUP)
PA1: J2.24 J6.2 U1.24(PA1)
PA2: J2.25 J5.2 U1.25(PA2)
PA3: J2.26 J5.1 U1.26(PA3)
PA4: J2.29 J6.3 U1.29(PA4)
PA5: J2.30 J3.6 U1.30(PA5)
PA6: J2.31 J3.5 U1.31(PA6)
PA7: J2.32 J3.4 U1.32(PA7)
PA8: J1.17 J5.8 U1.67(PA8)
PA9: J1.18 J3.1 JP2.2 U1.68(PA9)
PA10: J1.19 J5.3 J8.3 R9.2 U1.69(PA10)
PA11: R32.2 R55.1 U1.70(PA11)
PA11_E: J1.20 R32.1
PA12: R33.2 R54.1 U1.71(PA12)
PA12_E: J1.21 R33.1
PA13/SWDIO: CN2.3 CN7.3 J1.22 R44.2 U1.72(PA13)
PA14/SWCLK: CN2.5 CN7.5 J1.26 R41.2 U1.76(PA14)
PA15: J1.27 R39.2 U1.77(PA15)
PB0: J2.35 J6.4 U1.35(PB0)
PB1: J2.36 U1.36(PB1)
PB2: J2.37 U1.37(PB2)
PB3/SWO: CN2.6 J1.39 J5.4 U1.89(PB3)
PB4: J1.40 J5.6 U1.90(PB4)
PB5: J1.41 J5.5 U1.91(PB5)
PB6: J1.42 R38.2 U1.92(PB6)
PB7: J1.43 U1.93(PB7)
PB8: J1.45 J3.10 R36.2 U1.95(PB8)
PB9: J1.46 J3.9 R35.2 U1.96(PB9)
PB10: J2.47 J5.7 U1.47(PB10)
PB11: J2.48 J7.8 U1.48(PB11)
PB12: J1.1 J7.7 U1.51(PB12)
PB13: J1.2 J7.3 U1.52(PB13)
PB14: J1.3 J7.1 U1.53(PB14)
PB15: J1.4 J7.4 U1.54(PB15)
PC0: J2.15 R37.2 U1.15(PC0)
PC1: J2.16 R34.2 U1.16(PC1)
PC2: J2.17 U1.17(PC2)
PC3: J2.18 U1.18(PC3)
PC4: J2.33 U1.33(PC4)
PC5: J2.34 U1.34(PC5)
PC6: J1.13 U1.63(PC6)
PC7: J1.14 J3.2 U1.64(PC7)
PC8: J1.15 U1.65(PC8)
PC9: J1.16 U1.66(PC9)
PC10: J1.28 U1.78(PC10)
PC11: J1.29 U1.79(PC11)
PC12: J1.30 U1.80(PC12)
PC13: J2.7 R6.1 U1.7(PC13/TAMPER-RTC)
PC14/LEXT_IN: R22.1 R24.1 U1.8(PC14/LEXT_IN)
PC14_E: J2.8 R24.2
PC15/LEXT_OUT: R23.1 R25.1 U1.9(PC15/LEXT_OUT)
PC15_E: J2.9 R25.2
PD0: J1.31 U1.81(PD0)
PD1: J1.32 U1.82(PD1)
PD2: J1.33 U1.83(PD2)
PD3: J1.34 U1.84(PD3)
PD4: J1.35 U1.85(PD4)
PD5: J1.36 U1.86(PD5)
PD6: J1.37 U1.87(PD6)
PD7: J1.38 U1.88(PD7)
PD8: J1.5 U1.55(PD8)
PD9: J1.6 U1.56(PD9)
PD10: J1.7 U1.57(PD10)
PD11: J1.8 U1.58(PD11)
PD12: J1.9 U1.59(PD12)
PD13/LED2: J1.10 LED2.2(CATHODE) U1.60(PD13)
PD14/LED3: J1.11 LED3.2(CATHODE) U1.61(PD14)
PD15/LED4: J1.12 LED4.2(CATHODE) U1.62(PD15)
PE0: J1.47 U1.97(PE0)
PE1: J1.48 U1.98(PE1)
PE2: J2.1 U1.1(PE2)
PE3: J2.2 U1.2(PE3)
PE4: J2.3 U1.3(PE4)
PE5: J2.4 U1.4(PE5)
PE6: J2.5 U1.5(PE6)
PE7: J2.38 U1.38(PE7)
PE8: J2.39 U1.39(PE8)
PE9: J2.40 U1.40(PE9)
PE10: J2.41 U1.41(PE10)
PE11: J2.42 U1.42(PE11)
PE12: J2.43 U1.43(PE12)
PE13: J2.44 U1.44(PE13)
PE14: J2.45 U1.45(PE14)
PE15: J2.46 U1.46(PE15)
PF0/HEXT_IN: R26.1 R28.1 U1.12(PF0/HEXT_IN)
PF0_E: J2.12 R28.2
PF1/HEXT_OUT: R27.1 R29.1 U1.13(PF1/HEXT_OUT)
PF1_E: J2.13 R29.2
PF2: J2.19 U1.19(PF2)
PF6: J1.23 U1.73(PF6)
PF8: J2.49 U1.49(PF8)
PF9: J2.10 U1.10(PF9)
PF10: J2.11 U1.11(PF10)
SWO: CN7.6 R52.2
USART1_TX: J8.2 JP2.1 R10.2
USB+: CN6.A6(DP1) CN6.B6(DP2) R11.1 TP3.3
USB-: CN6.A7(DN1) CN6.B7(DN2) R12.1 TP3.2
VREF+: C37.2 C38.2 J3.8 L2.2 U1.21(VREF+)
$1N323: J9.2 U6.44(BOOT0)
$1N349: LD4.1(ANODE) RP1.5
$1N350: LD3.1(ANODE) RP1.6
$1N351: LD2.1(ANODE) RP1.7
$1N352: LD1.1(ANODE) RP1.8
$1N378: C15.2 C16.2 C18.2 C19.2 F2.2 U5.1(IN) U5.3(EN) U7.1(IN) U7.3(EN)
$1N419: R50.1 R51.2 U5.4(SNS)
$1N495: R43.1 R49.2 U7.4(SNS)
$2N102: C25.2 R26.2 X2.1(OSC1)
$2N103: C26.2 R27.2 X2.3(OSC2)
$2N208: C24.2 R23.2 X1.2
$2N210: C23.2 R22.2 X1.1
$2N318: JP1.2 R31.1
$3N116: C3.2 D2.2 R1.2 U2.5(OUT)
$3N117: R1.1 R2.2 U2.4(SNS)
$3N122: LED1.1(ANODE) R3.1
$3N126: B2.3 B2.4 R5.2 R6.2 R7.2
$3N170: LED3.1(ANODE) R15.1
$3N171: LED2.1(ANODE) R14.1
$3N172: LED4.1(ANODE) R16.1
$3N7076: CN5.A5(CC1) R18.1
$3N7077: CN5.B5(CC2) R19.1
$3N33030: JP2.3 R8.1
$4N197: J6.5 R34.1 R35.1
$4N198: J6.6 R36.1 R37.1
$4N262: J3.3 R38.1 R39.1

Not connected (* = marked no-connect by the designer): CN5 A8(SBU1)* B8(SBU2)*; CN6 A8(SBU1)* B8(SBU2)*; J2 21* 22*; J4 1* 8*; U6 2(PC13/TAMPER-RTC) 3(PC14/LEXT_IN) 4(PC15/LEXT_OUT) 5(PD0/HEXT_IN) 6(PD1/HEXT_OUT) 14(PA4) 15(PA5) 16(PA6) 17(PA7) 18(PB0) 21(PB10) 22(PB11) 29(PA8) 38(PA15) 41(PB5) 42(PB6) 43(PB7) 45(PB8) 46(PB9)

## Notes on the sheets
sheet 1
- Close to slot
- For Test
- AT-Link USB
- AT-Link power supply
- LD1-4:For AT-Link-EZ status
- AT-Link-EZ V1.4
- AT-Link MCU
- 2024-03-29
sheet 2
- MCU power supply
- Crystal
- MCU
- MCU
- Boot & Reset
- 2024-03-29
sheet 3
- 3.5V
- Default:R13 ON
- JP3 for MCU current measurement
- AT-START power supply
- USB host
- User key
- LED
- USB device
- Test points
- Power & Peripherals
- AT-Link connector
- USART1 for ISP
- 2024-03-29
sheet 4
- SCL
- SDA
- AREF
- D13
- D12
- D11
- D10
- D9
- D8
- MCU
- AN0
- D7
- AN1
- D6
- AN2
- AN3
- D4
- D5
- AN4
- D3
- AN5
- D2
- D1
- D0
- SCK
- MISO
- NSS
- MOSI
- Arduino UNO R3 connectors
- Extension connectors
- LQFP100 I/O extension connectors
- 2024-03-29
